# Altium project Board.PrjPcb (part 2 of 2)
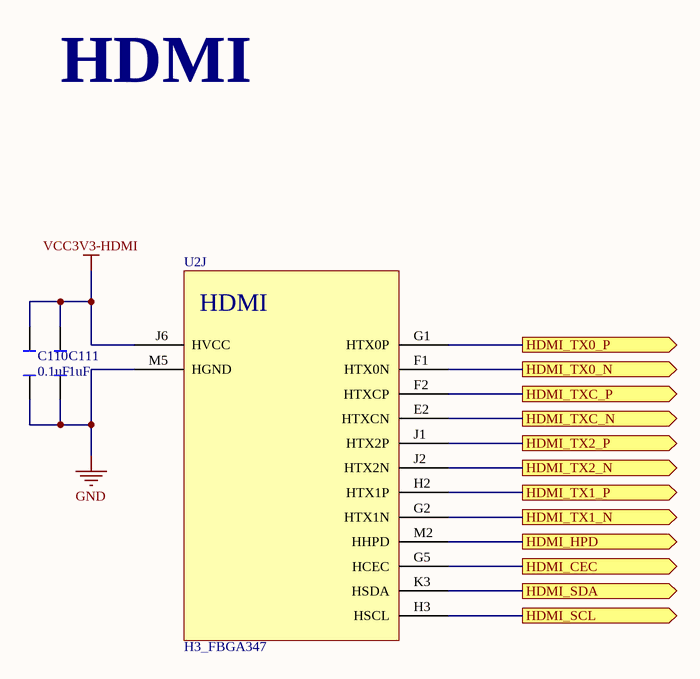
[diagram p12: 07_H3HDMI.SchDoc]

## Nets that join several sheets
GND: 00_PINOUT (117 pins), 01_POWER (61 pins), 02_H3CORE (66 pins), 03_H3DRAM (83 pins), 04_H3STORAGE (18 pins), 06_H3ETHERNET (C107#2.1 C108.1), 07_H3HDMI (C110.1 C111.1 U2.M5)
VCC-1V2-CPU: 01_POWER (8 pins), 02_H3CORE (15 pins)
VCC-1V2-SYS: 01_POWER (10 pins), 02_H3CORE (12 pins)
VCC-1V5: 01_POWER (C11.1 C16.1 L4.1 U1.5), 03_H3DRAM (78 pins)
VCC-3V3: 01_POWER (13 pins), 02_H3CORE (11 pins), 04_H3STORAGE (19 pins), 06_H3ETHERNET (C107#2.2 U2.G7 U2.J15), 07_H3HDMI (C110.2 C111.2 U2.J6)
VCC-3V3-ANALOG: 01_POWER (C28.1 C29.2 U1.32), 02_H3CORE (C59.2 C60#2.2 U2.G9 U2.V3)
VCC-3V3-RTC: 01_POWER (6 pins), 02_H3CORE (R15.2 R16.2 U2.K6)
VCC-5V: 00_PINOUT (8 pins), 01_POWER (5 pins)
VCC-BAT: 00_PINOUT (8 pins), 01_POWER (C3.2 R6.2 U1.49)
VDD1V2-EPHY: 01_POWER (R13.2), 06_H3ETHERNET (C108.2 U2.F8)
CSI_D0: 00_PINOUT (J1.105), 02_H3CORE (U2.C9)
CSI_D1: 00_PINOUT (J1.125), 02_H3CORE (U2.E10)
CSI_D2: 00_PINOUT (J1.46), 02_H3CORE (U2.D10)
CSI_D3: 00_PINOUT (J1.48), 02_H3CORE (U2.C8)
CSI_D4: 00_PINOUT (J1.101), 02_H3CORE (U2.C11)
CSI_D5: 00_PINOUT (J1.97), 02_H3CORE (U2.C12)
CSI_D6: 00_PINOUT (J1.123), 02_H3CORE (U2.E8)
CSI_D7: 00_PINOUT (J1.53), 02_H3CORE (U2.A11)
CSI_HSYNC: 00_PINOUT (J1.59), 02_H3CORE (U2.B11)
CSI_MCLK: 00_PINOUT (J1.57), 02_H3CORE (U2.A10)
CSI_PCLK: 00_PINOUT (J1.61), 02_H3CORE (U2.B10)
CSI_SCK: 00_PINOUT (J1.51), 02_H3CORE (U2.B12)
CSI_SDA: 00_PINOUT (J1.113), 02_H3CORE (U2.C7)
CSI_VSYNC: 00_PINOUT (J1.103), 02_H3CORE (U2.C10)
DCDC4: 00_PINOUT (J1.239 J1.241 J1.243), 01_POWER (C44.1 C45.1 L6.1 U1.67)
DLDO1: 00_PINOUT (J1.257 J1.259), 01_POWER (C51.2 U1.19)
DLDO2: 00_PINOUT (J1.251 J1.253 J1.255), 01_POWER (C50.2 U1.17)
DLDO3: 00_PINOUT (J1.245 J1.247 J1.249), 01_POWER (C49.2 U1.16)
DLDO4: 00_PINOUT (J1.233 J1.235 J1.237), 01_POWER (C48.2 U1.20)
ELDO1: 00_PINOUT (J1.230 J1.232 J1.234), 01_POWER (U1.68)
ELDO2: 00_PINOUT (J1.222 J1.224 J1.226), 01_POWER (U1.2)
ELDO3: 00_PINOUT (J1.214 J1.216 J1.218 J1.220), 01_POWER (U1.3)
HDMI_CEC: 00_PINOUT (J1.132), 07_H3HDMI (U2.G5)
HDMI_HPD: 00_PINOUT (J1.140), 07_H3HDMI (U2.M2)
HDMI_SCL: 00_PINOUT (J1.128), 07_H3HDMI (U2.H3)
HDMI_SDA: 00_PINOUT (J1.136), 07_H3HDMI (U2.K3)
HDMI_TX0_N: 00_PINOUT (J1.110), 07_H3HDMI (U2.F1)
HDMI_TX0_P: 00_PINOUT (J1.112), 07_H3HDMI (U2.G1)
HDMI_TX1_N: 00_PINOUT (J1.116), 07_H3HDMI (U2.G2)
HDMI_TX1_P: 00_PINOUT (J1.118), 07_H3HDMI (U2.H2)
HDMI_TX2_N: 00_PINOUT (J1.124), 07_H3HDMI (U2.J2)
HDMI_TX2_P: 00_PINOUT (J1.122), 07_H3HDMI (U2.J1)
HDMI_TXC_N: 00_PINOUT (J1.106), 07_H3HDMI (U2.E2)
HDMI_TXC_P: 00_PINOUT (J1.104), 07_H3HDMI (U2.F2)
I2C0_SCL: 00_PINOUT (J1.78), 02_H3CORE (U2.F11)
I2C0_SDA: 00_PINOUT (J1.55), 02_H3CORE (U2.C13)
I2S0_CLK: 00_PINOUT (J1.43), 02_H3CORE (U2.B14)
I2S0_DIN: 00_PINOUT (J1.41), 02_H3CORE (U2.A14)
I2S0_DOUT: 00_PINOUT (J1.45), 02_H3CORE (U2.A13)
I2S0_SYNC: 00_PINOUT (J1.47), 02_H3CORE (U2.B13)
JTAG_CK: 00_PINOUT (J1.35), 02_H3CORE (U2.C20)
JTAG_DI: 00_PINOUT (J1.37), 02_H3CORE (U2.A19)
JTAG_DO: 00_PINOUT (J1.39), 02_H3CORE (U2.F18)
JTAG_MS: 00_PINOUT (J1.33), 02_H3CORE (U2.D19)
LED_DISK: 00_PINOUT (J1.4), 01_POWER (R4.2), 02_H3CORE (U2.M6)
LED_ERR: 00_PINOUT (J1.6), 01_POWER (R8.2), 02_H3CORE (U2.V2)
LED_ID: 00_PINOUT (J1.2), 01_POWER (R3.2), 02_H3CORE (U2.U2)
LED_LINK: 01_POWER (R10.1), 06_H3ETHERNET (U2.A2)
LED_SPD: 01_POWER (R12.1), 06_H3ETHERNET (U2.F7)
LINEIN_L: 00_PINOUT (J1.166), 02_H3CORE (U2.V1)
LINEIN_R: 00_PINOUT (J1.164), 02_H3CORE (U2.W1)
LINEOUT_L: 00_PINOUT (J1.154), 02_H3CORE (U2.AA3)
LINEOUT_R: 00_PINOUT (J1.158), 02_H3CORE (U2.Y3)
MICIN1_N: 00_PINOUT (J1.146), 02_H3CORE (U2.Y1)
MICIN1_P: 00_PINOUT (J1.160), 02_H3CORE (U2.W2)
MICIN2_N: 00_PINOUT (J1.152), 02_H3CORE (U2.AA2)
MICIN2_P: 00_PINOUT (J1.148), 02_H3CORE (U2.Y2)
NetR5_1: 01_POWER (R5.1 U1.45), 02_H3CORE (U2.M1)
NetR7_1: 01_POWER (R7.1 U1.44), 02_H3CORE (U2.N1)
NetR9_1: 01_POWER (R9.1 U1.29), 02_H3CORE (U2.P2)
NetU1_28: 01_POWER (U1.28), 02_H3CORE (U2.T10)
NTC: 00_PINOUT (J1.228), 01_POWER (R2.2 U1.30)
PA4: 00_PINOUT (J1.81), 02_H3CORE (U2.F5)
PA17: 00_PINOUT (J1.49), 02_H3CORE (U2.C14)
PE14: 00_PINOUT (J1.115), 02_H3CORE (U2.C6)
PE15: 00_PINOUT (J1.117), 02_H3CORE (U2.C5)
PF6: 00_PINOUT (J1.27), 02_H3CORE (U2.G18)
PG11: 00_PINOUT (J1.77), 02_H3CORE (U2.D2)
PG12: 00_PINOUT (J1.79), 02_H3CORE (U2.D1)
PG13: 00_PINOUT (J1.71), 02_H3CORE (U2.B1)
PWR_KEY: 00_PINOUT (J1.236), 01_POWER (U1.12)
PWR_OK: 00_PINOUT (J1.212), 01_POWER (U1.43), 02_H3CORE (U2.V6)
RGMII_CLKIN: 00_PINOUT (J1.18), 06_H3ETHERNET (U2.K18)
RGMII_MDC: 00_PINOUT (J1.14), 06_H3ETHERNET (U2.L18)
RGMII_MDIO: 00_PINOUT (J1.10), 06_H3ETHERNET (U2.L19)
RGMII_RX0: 00_PINOUT (J1.26), 06_H3ETHERNET (U2.H18)
RGMII_RX1: 00_PINOUT (J1.38), 06_H3ETHERNET (U2.B20)
RGMII_RX2: 00_PINOUT (J1.22), 06_H3ETHERNET (U2.H17)
RGMII_RX3: 00_PINOUT (J1.34), 06_H3ETHERNET (U2.C21)
RGMII_RXCK: 00_PINOUT (J1.42), 06_H3ETHERNET (U2.A20)
RGMII_RXCTL: 00_PINOUT (J1.30), 06_H3ETHERNET (U2.F19)
RGMII_TXCK: 00_PINOUT (J1.19), 06_H3ETHERNET (U2.E19)
RGMII_TXCTL: 00_PINOUT (J1.3), 06_H3ETHERNET (U2.K17)
RGMII_TXD0: 00_PINOUT (J1.11), 06_H3ETHERNET (U2.H19)
RGMII_TXD1: 00_PINOUT (J1.7), 06_H3ETHERNET (U2.F21)
RGMII_TXD2: 00_PINOUT (J1.23), 06_H3ETHERNET (U2.E20)
RGMII_TXD3: 00_PINOUT (J1.15), 06_H3ETHERNET (U2.E18)
SDC1_CLK: 00_PINOUT (J1.83), 02_H3CORE (U2.J3)
SDC1_CMD: 00_PINOUT (J1.109), 02_H3CORE (U2.L2)
SDC1_D0: 00_PINOUT (J1.107), 02_H3CORE (U2.H4)
SDC1_D1: 00_PINOUT (J1.69), 02_H3CORE (U2.F3)
SDC1_D2: 00_PINOUT (J1.73), 02_H3CORE (U2.C2)
SDC1_D3: 00_PINOUT (J1.75), 02_H3CORE (U2.C1)
SIM_DATA: 00_PINOUT (J1.85), 02_H3CORE (U2.F13)
SIM_PWREN: 00_PINOUT (J1.91), 02_H3CORE (U2.E14)
SIM_RST: 00_PINOUT (J1.95), 02_H3CORE (U2.D13)
SPI1_CLK: 00_PINOUT (J1.80), 02_H3CORE (U2.G12)
SPI1_CS: 00_PINOUT (J1.89), 02_H3CORE (U2.E15)
SPI1_MISO: 00_PINOUT (J1.93), 02_H3CORE (U2.D15)
SPI1_MOSI: 00_PINOUT (J1.87), 02_H3CORE (U2.F14)
TVOUT: 00_PINOUT (J1.127), 02_H3CORE (U2.F10)
UART0_RX: 00_PINOUT (J1.29), 02_H3CORE (U2.E21)
UART0_TX: 00_PINOUT (J1.31), 02_H3CORE (U2.D20)
UART1_RX: 00_PINOUT (J1.67), 02_H3CORE (U2.D3)
UART1_TX: 00_PINOUT (J1.129), 02_H3CORE (U2.G4)
UART2_RTS: 00_PINOUT (J1.121), 02_H3CORE (U2.D6)
UART2_RX: 00_PINOUT (J1.119), 02_H3CORE (U2.D5)
UART2_TX: 00_PINOUT (J1.99), 02_H3CORE (U2.D11)
UBOOT: 00_PINOUT (J1.111), 02_H3CORE (U2.W6)
USB0_N: 00_PINOUT (J1.66), 02_H3CORE (U2.B5)
USB0_P: 00_PINOUT (J1.64), 02_H3CORE (U2.A5)
USB1_N: 00_PINOUT (J1.72), 02_H3CORE (U2.B7)
USB1_P: 00_PINOUT (J1.70), 02_H3CORE (U2.B6)
USB2_N: 00_PINOUT (J1.58), 02_H3CORE (U2.A8)
USB2_P: 00_PINOUT (J1.60), 02_H3CORE (U2.A7)
USB3_N: 00_PINOUT (J1.52), 02_H3CORE (U2.B9)
USB3_P: 00_PINOUT (J1.54), 02_H3CORE (U2.B8)